# EAGLE design Y-babies ATtiny84 v07 (EAGLE 6.5.0)
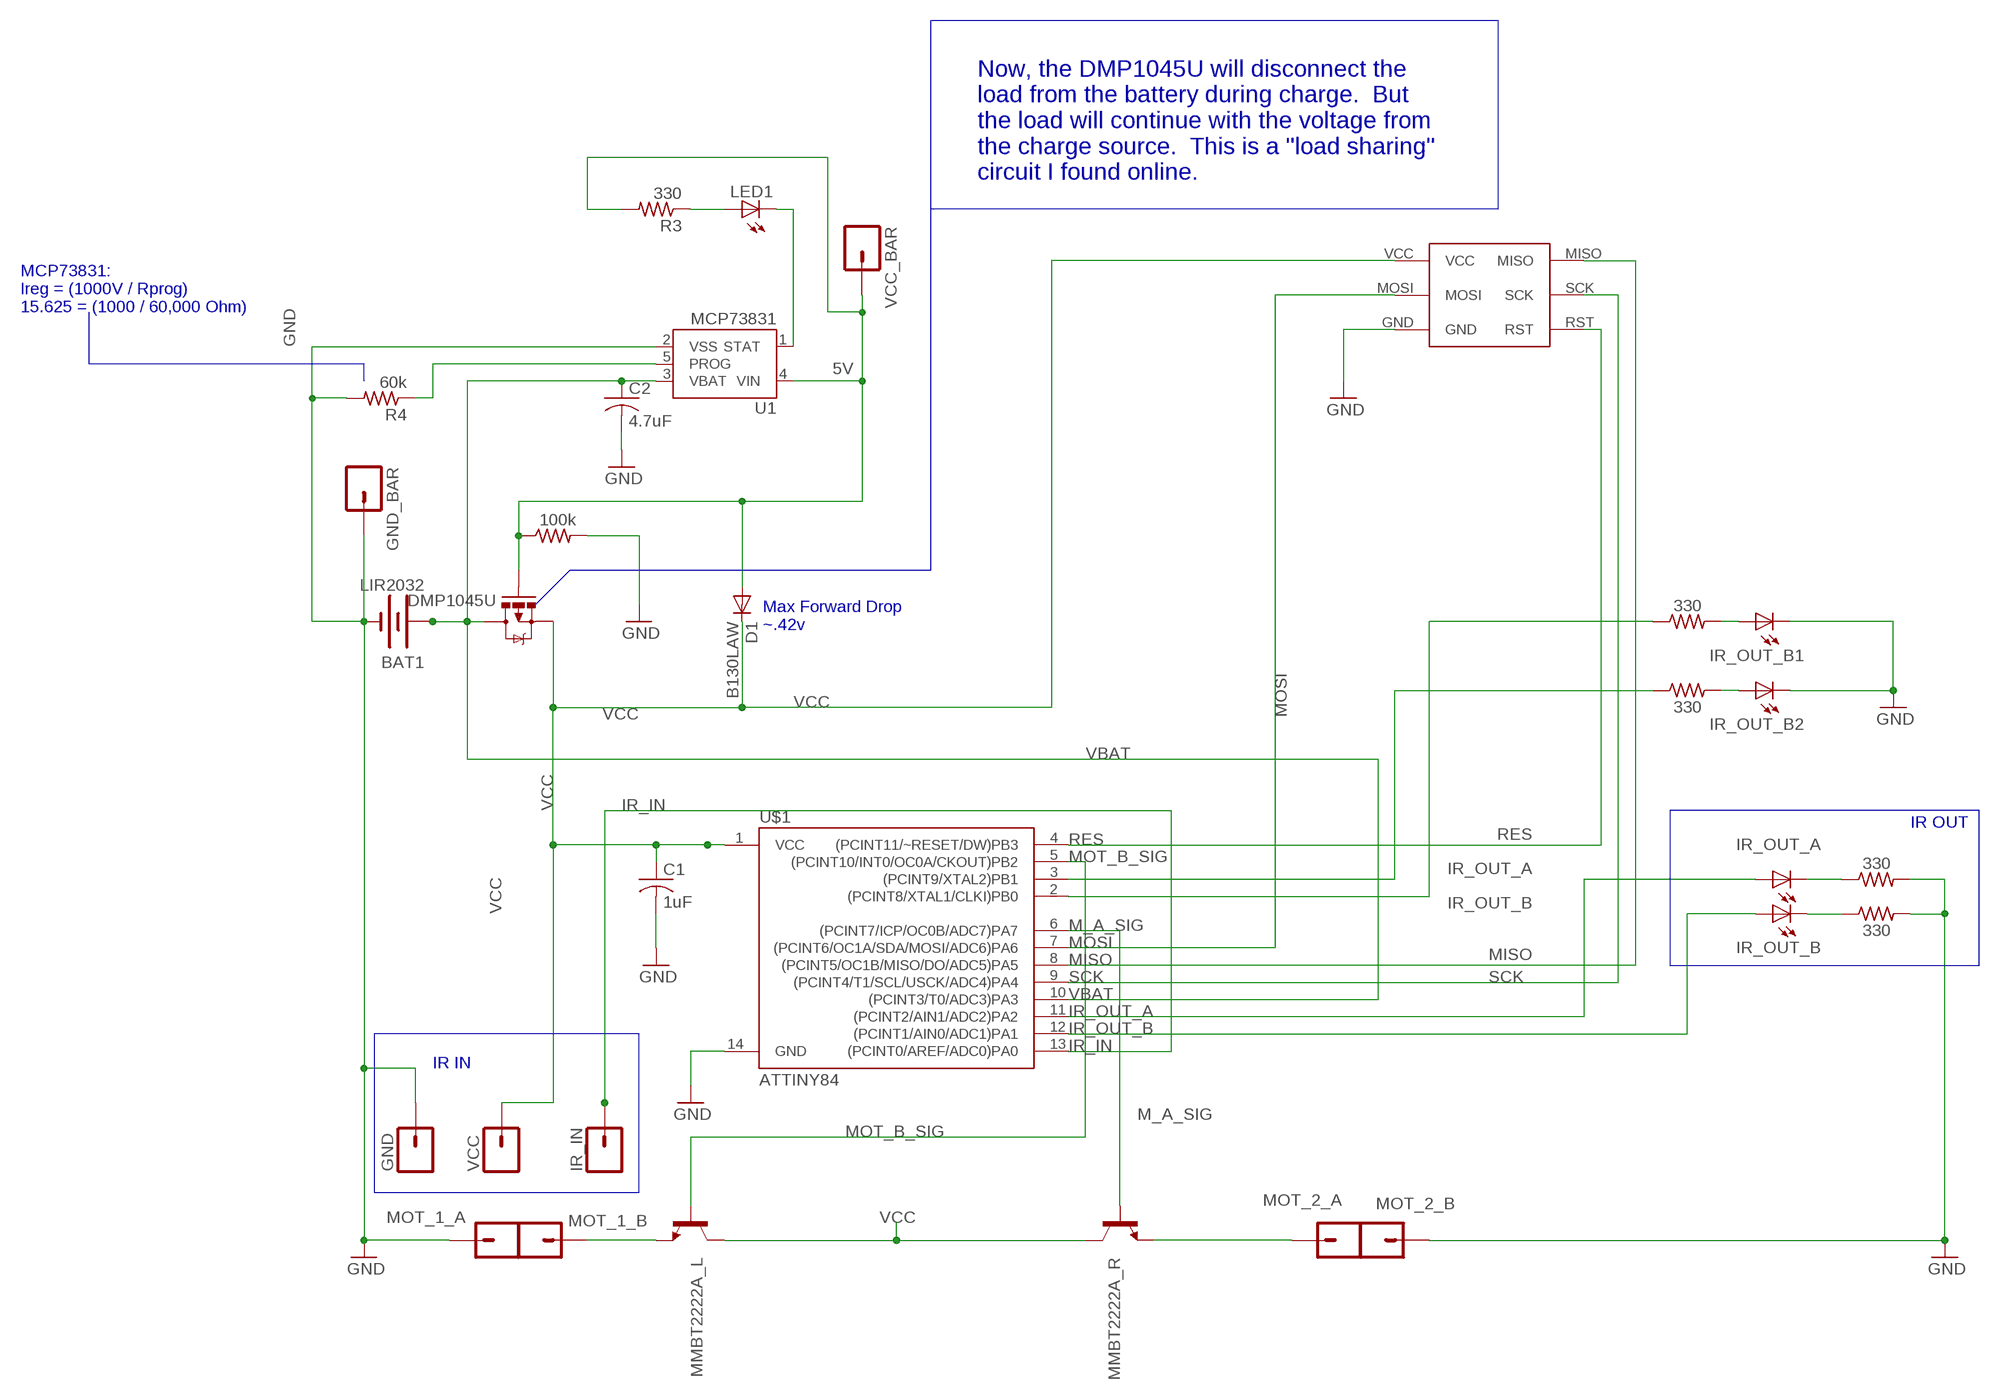
[diagram p0: schematic, sheet 1]

## Parts
BAT1  LIR2032  BATTERY20PTH  [BATTCOM_20MM_PTH]
C1  1uF  C-USC0402K  [C0402K]
C2  4.7uF  C-USC0805K  [C0805K]
D1  B130LAW  DIODE-SOD123  [SOD123]
DMP1045U  MOSFET-PCHANNELSMD  [SOT23-3]
GND  M01PTH  [1X01]
GND_BAR  M01PTH  [1X01]
IR_IN  M01PTH  [1X01]
IR_OUT_A  LED3MM  [LED3MM]
IR_OUT_B  LED3MM  [LED3MM]
IR_OUT_B1  LEDSML0603  [SML0603]
IR_OUT_B2  LEDSML0603  [SML0603]
LED1  LEDSML0603  [SML0603]
MMBT2222A_L  TRANSISTOR_NPNSOT23  [SOT23]
MMBT2222A_R  TRANSISTOR_NPNSOT23  [SOT23]
MOT_1_A  M01SMD-4.5X1.5  [PAD-1.5X4.5]
MOT_1_B  M01SMD-4.5X1.5  [PAD-1.5X4.5]
MOT_2_A  M01SMD-4.5X1.5  [PAD-1.5X4.5]
MOT_2_B  M01SMD-4.5X1.5  [PAD-1.5X4.5]
R1  330  R-US_R0402  [R0402]
R2  330  R-US_R0402  [R0402]
R3  330  R-US_R0402  [R0402]
R4  60k  R-US_R0402  [R0402]
R5  100k  R-US_R0402  [R0402]
R6  330  R-US_R0402  [R0402]
R7  330  R-US_R0402  [R0402]
U1  MCP73831  [SOT23-5]
U$1  ATTINY84  [SO14]
U$2  POGO_PIN_SPI_PAD  [POGO_PIN_SPI_PAD]
VCC  M01PTH  [1X01]
VCC_BAR  M01PTH  [1X01]

## Nets
5V: D1.A DMP1045U.1(G) R3.2 R5.1 U1.4(VIN) VCC_BAR.1
GND: BAT1.2(-) C1.2 C2.2 GND.1 GND_BAR.1 IR_OUT_B1.C IR_OUT_B2.C MOT_1_A.P$1 MOT_2_B.P$1 R1.2 R2.2 R4.2 R5.2 U1.2(VSS) U$1.14(GND) U$2.GND
IR_IN: IR_IN.1 U$1.13((PCINT0/AREF/ADC0)PA0)
IR_OUT_A: IR_OUT_A.A U$1.11((PCINT2/AIN1/ADC2)PA2)
IR_OUT_B: IR_OUT_B.A U$1.12((PCINT1/AIN0/ADC1)PA1)
M_A_IN: MMBT2222A_R.2(E) MOT_2_A.P$1
M_A_SIG: MMBT2222A_R.1(B) U$1.6((PCINT7/ICP/OC0B/ADC7)PA7)
MISO: U$1.8((PCINT5/OC1B/MISO/DO/ADC5)PA5) U$2.MISO
MOSI: U$1.7((PCINT6/OC1A/SDA/MOSI/ADC6)PA6) U$2.MOSI
MOT_B_IN: MMBT2222A_L.2(E) MOT_1_B.P$1
MOT_B_SIG: MMBT2222A_L.1(B) U$1.5((PCINT10/INT0/OC0A/CKOUT)PB2)
N$1: LED1.C U1.1(STAT)
N$2: LED1.A R3.1
N$3: R7.1 U$1.2((PCINT8/XTAL1/CLKI)PB0)
N$5: IR_OUT_B1.A R7.2
N$6: IR_OUT_B2.A R6.2
N$7: IR_OUT_A.K(C) R1.1
N$8: IR_OUT_B.K(C) R2.1
N$9: R6.1 U$1.3((PCINT9/XTAL2)PB1)
N$10: R4.1 U1.5(PROG)
RES: U$1.4((PCINT11/~RESET/DW)PB3) U$2.RST
SCK: U$1.9((PCINT4/T1/SCL/USCK/ADC4)PA4) U$2.SCK
VBAT: BAT1.1(+) C2.1 DMP1045U.3(D) U1.3(VBAT) U$1.10((PCINT3/T0/ADC3)PA3)
VCC: C1.1 D1.C DMP1045U.2(S) MMBT2222A_L.3(C) MMBT2222A_R.3(C) U$1.1(VCC) U$2.VCC VCC.1

## Buses
B$1
B$2
B$3
B$4

## Notes on the sheet
- Now, the DMP1045U will disconnect the
  load from the battery during charge.  But
  the load will continue with the voltage from
  the charge source.  This is a "load sharing" 
  circuit I found online.
- MCP73831:
  Ireg = (1000V / Rprog)
  15.625 = (1000 / 60,000 Ohm)
- Max Forward Drop
  ~.42v
- IR OUT
- IR IN

## Library data of the parts
BAT1 = SparkFun-Electromechanical:BATTERY: Battery Holders Various common sizes : AA, AAA, 20mm coin cell and 12mm coin cell. 20MM_4LEGS, BATT-10373
C1 C2 = resistor:C-US: CAPACITOR, American symbol
D1 = diode:DIODE-: DIODE
DMP1045U = SparkFun-DiscreteSemi:MOSFET-PCHANNEL: Generic PMOSFET
GND GND_BAR IR_IN MOT_1_A MOT_1_B MOT_2_A MOT_2_B VCC VCC_BAR = SparkFun:M01: Header 1 Standard 1-pin 0.1" header. Use with straight break away headers (SKU : PRT-00116), right angle break away headers (PRT-00553), swiss pins (PRT-00743), machine pins (PRT-00117), and female headers (PRT-00115).
IR_OUT_A IR_OUT_B IR_OUT_B1 IR_OUT_B2 LED1 = led:LED: LED OSRAM: - CHIPLED LG R971, LG N971, LY N971, LG Q971, LY Q971, LO R971, LY R971 LH N974, LH R974 LS Q976, LO Q976, LY Q976 LO Q996 - Hyper CHIPLED LW Q18S LB Q993, LB Q99A, LB R99A - SideLED LS A670, LO A670, LY A670, LG A670, LP A670 LB A673, LV A673, LT A673, LW A673 LH A674 LY A675 LS A676, LA A676, LO A676, LY A676, LW A676 LS A679, LY A679, LG A679 - Hyper Micro SIDELED® LS Y876, LA Y876, LO Y876, LY Y876 LT Y87S - SmartLED LW L88C, LW L88S LB L89C, LB L89S, LG L890 LS L89K, LO L89K, LY L89K LS L896, LA L896, LO L896, LY L896 - TOPLED LS T670, LO T670, LY T670, LG T670, LP T670 LSG T670, LSP T670, LSY T670, LOP T670, LYG T670 LG T671, LOG T671, LSG T671 LB T673, LV T673, LT T673, LW T673 LH T674 LS T676, LA T676, LO T676, LY T676, LB T676, LH T676, LSB T676, LW T676 LB T67C, LV T67C, LT T67C, LS T67K, LO T67K, LY T67K, LW E67C LS E67B, LA E67B, LO E67B, LY E67B, LB E67C, LV E67C, LT E67C LW T67C LS T679, LY T679, LG T679 LS T770, LO T770, LY T770, LG T770, LP T770 LB T773, LV T773, LT T773, LW T773 LH T774 LS E675, LA E675, LY E675, LS T675 LS T776, LA T776, LO T776, LY T776, LB T776 LHGB T686 LT T68C, LB T68C - Hyper Mini TOPLED® LB M676 - Mini TOPLED Santana® LG M470 LS M47K, LO M47K, LY M47K Source: http://www.osram.convergy.de LUXEON: - LUMILED® LXK2-PW12-R00, LXK2-PW12-S00, LXK2-PW14-U00, LXK2-PW14-V00 LXK2-PM12-R00, LXK2-PM12-S00, LXK2-PM14-U00 LXK2-PE12-Q00, LXK2-PE12-R00, LXK2-PE12-S00, LXK2-PE14-T00, LXK2-PE14-U00 LXK2-PB12-K00, LXK2-PB12-L00, LXK2-PB12-M00, LXK2-PB14-N00, LXK2-PB14-P00, LXK2-PB14-Q00 LXK2-PR12-L00, LXK2-PR12-M00, LXK2-PR14-Q00, LXK2-PR14-R00 LXK2-PD12-Q00, LXK2-PD12-R00, LXK2-PD12-S00 LXK2-PH12-R00, LXK2-PH12-S00 LXK2-PL12-P00, LXK2-PL12-Q00, LXK2-PL12-R00 Source: www.luxeon.com KINGBRIGHT: KA-3528ASYC Source: www.kingbright.com
MMBT2222A_L MMBT2222A_R = SparkFun:TRANSISTOR_NPN: Transistor NPN BJT configuration in SOT23 package. MMBT2222 is the common NPN we use. Double check BCE configuration again layout.
R1-R7 = resistor:R-US_: RESISTOR, American symbol
U1 = SparkFun-PowerIC:MCP73831: Miniature single cell, fully integrated Li-Ion, Li-polymer charge management controller http://ww1.microchip.com/downloads/en/DeviceDoc/21984a.pdf IC-09995; PROD_ID: IC-09995
U$1 = SparkFun-DigitalIC:ATTINY84: Atmel 14-pin 2/4/8kB flash uC
U$2 = Random parts:POGO_PIN_SPI_PAD

## Board
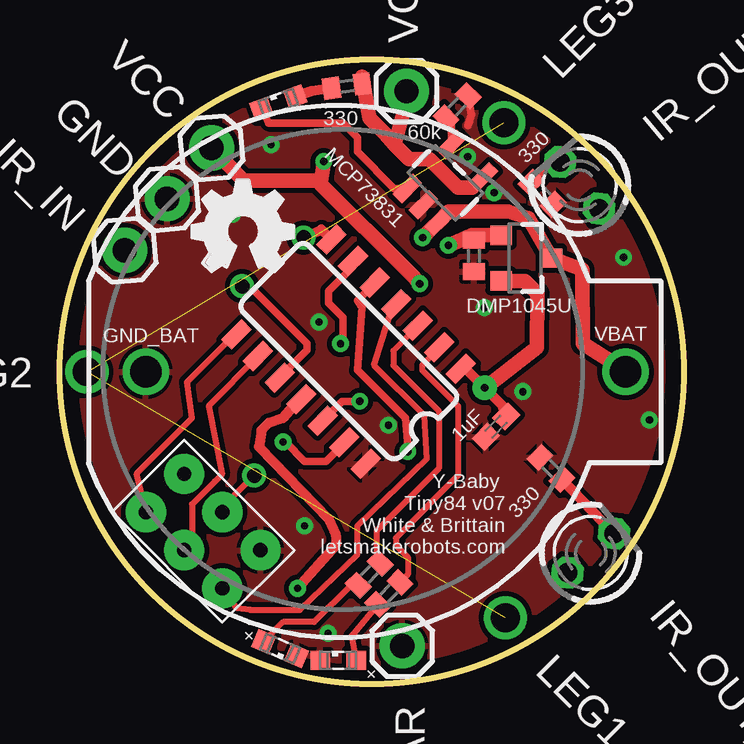
[diagram p1: board, top side]
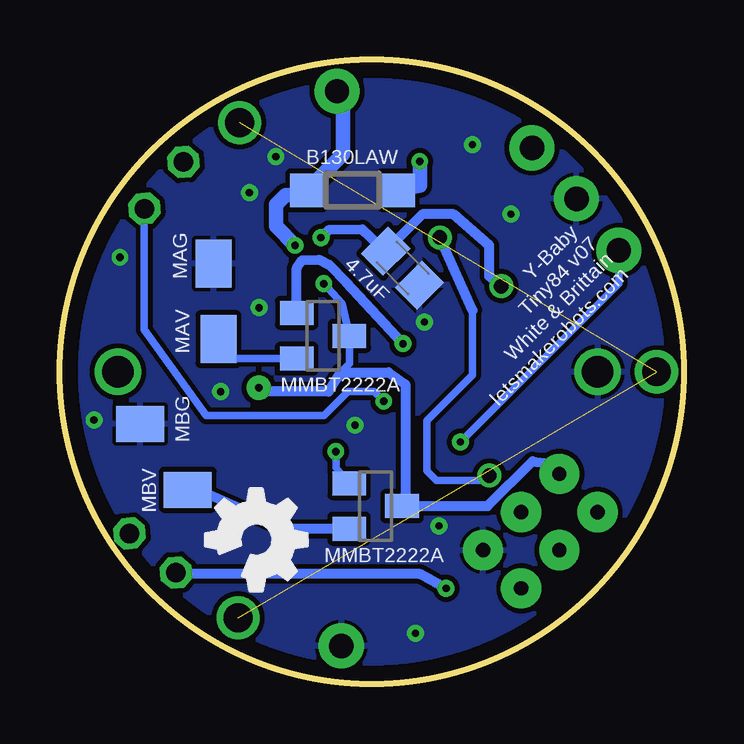
[diagram p2: board, bottom side, seen from below]

Size 26 x 26 mm. Coordinates in mm from the lower left corner, seen from the top.
Outline: circle at 13,13 radius 13
Copper layers (1*16): Top 0.035mm / dielectric 1.5mm / Bottom 0.035mm
Design rules "default *": minimum track width 10mil, minimum drill 24mil, track to track 8mil, track to pad 8mil, pad to pad 8mil, via to via 8mil, smd to smd 8mil, copper to edge 25mil, drill to drill 8mil, minimum pad ring 10mil, minimum via ring 8mil, stop-mask expansion 4mil, vias tented up to drill 0mil, thermal gap 6mil

### Footprints (pad centres in the part's own frame; a part is rotated, then mirrored left to right if it is on the bottom)
BATTCOM_20MM_PTH = drill 1.3: 1 11.85,0; 2 -8.15,0
C0402K = smd 0.925 x 0.74: 1 -0.6,0; 2 0.6,0
C0805K = smd 1.3 x 1.6: 1 -1,0; 2 1,0
SOD123 = smd 1.4 x 1.4: A 1.9,0; C -1.9,0
SOT23-3 = smd 0.8 x 0.9: 1 -0.95,-1; 2 0.95,-1; 3 0,1.1
1X01 = drill 1.016 pad 1.88: 1 0,0
LED3MM = drill 0.813 octagon: A -1.27,0; K 1.27,0
SML0603 = smd 0.8 x 0.8: A 0.75,0; C -0.75,0
SOT23 = smd 1 x 1.4: 1 -0.95,-1.1; 2 0.95,-1.1; 3 0,1.1
PAD-1.5X4.5 = smd 1.5 x 2: P$1 0,0
R0402 = smd 0.7 x 0.9: 1 -0.65,0; 2 0.65,0
SOT23-5 = smd 0.55 x 1.2: 1 -0.95,-1.3; 2 0,-1.3; 3 0.95,-1.3; 4 0.95,1.3; 5 -0.95,1.3
SO14 = smd 0.6 x 1.2: 1 -3.81,-2.8; 2 -2.54,-2.8; 3 -1.27,-2.8; 4 0,-2.8; 5 1.27,-2.8; 6 2.54,-2.8; 7 3.81,-2.8; 8 3.81,2.8; 9 2.54,2.8; 10 1.27,2.8; 11 0,2.8; 12 -1.27,2.8; 13 -2.54,2.8; 14 -3.81,2.8
POGO_PIN_SPI_PAD = drill 0.6 pad 1.676: GND 1,-1; MISO 3.25,-5.5; MOSI 1,-3.25; RST 3.25,-1; SCK 3.25,-3.25; VCC 1,-5.5

### Placement (x,y rotation side)
BAT1  11.73,13 0 top
C1  18.18,10.71 225 top
C2  11.71,17.32 315 bottom
D1  13.8,20.57 180 bottom
DMP1045U  19.39,17.74 270 top
GND  4.46,20.22 5 top
GND_BAR  14.27,1.57 0 top
IR_IN  2.7,18.06 5 top
IR_OUT_A  22.13,5.44 40 top
IR_OUT_B  21.67,20.77 130 top
IR_OUT_B1  11.6,0.97 0 top
IR_OUT_B2  9.18,1.45 157 top
LED1  9.11,24.22 20 top
MMBT2222A_L  12.84,7.4 270 bottom
MMBT2222A_R  15.03,14.5 270 bottom
MOT_1_A  22.65,10.82 270 bottom
MOT_1_B  20.67,8.08 270 bottom
MOT_2_A  19.39,14.36 0 bottom
MOT_2_B  19.6,17.51 0 bottom
R1  20.47,8.97 135 top
R2  20.11,20.44 315 top
R3  11.97,24.91 8 top
R4  16.56,24.05 45 top
R5  17.26,17.83 270 top
R6  12.89,4.56 225 top
R7  13.71,3.76 225 top
U1  16.07,20.88 315 top
U$1  12.04,13.84 135 top
U$2  9.77,5.56 225 top
U$3  [OSHW_FILLX150_NOTEXT]  5.5,17.17 0 top
U$4  [OSHW_FILLX150_NOTEXT]  20.51,6.32 315 bottom
VCC  6.32,22.33 5 top
VCC_BAR  14.45,24.7 0 top

### Tracks (layer width: path | path; a pad name or v marks a point on that pad's centre or on a via)
5V  (via drill 0.3)
  Top 0.406: 12.6,25.29 R3.2 | 17.5,18.69 R5.1 | 17.2,20.67 U1.4
  Top 0.61: 13.95,22.47 14.55,21.87 14.9,21.87 15.4,21.87 16.6,20.67 17.2,20.67 | 13.95,22.47 14.3,23.75 VCC_BAR.1 | 13.95,22.47 13.55,22.92 12.9,23.57 12.6,25.29 | DMP1045U.1 17.5,18.69 17.18,18.69 v16.2,18.27
  Bottom 0.61: VCC_BAR.1 14.2,24.45 14.2,22.07 D1.A 15.7,20.47 15.8,20.37 16.6,20.37 17,19.97 17,19.07 v16.2,18.27
GND  (via drill 0.3)
  Top 0.305: R4.2 17.15,23.72 17,23.27
  other vias: 24.58,10.99 10.2,6.57 18.1,20.47 8.8,22.47 10.8,15.07 13.7,10.77 23.5,17.77 17,21.97 19.3,12.17 7.2,19.57 17.7,15.67 11.18,2.09
  pour Top: -0.97,-0.97 26.97,-0.97 26.97,26.97 -0.97,26.97
  pour Bottom: -0.97,-0.97 26.97,-0.97 26.97,26.97 -0.97,26.97
IR_IN  (via drill 0.3)
  Top 0.305: U$1.13 11.85,10.02 11.1,9.27 10.2,9.27 9.4,10.07 v9.3,10.07
  Bottom 0.305: IR_IN.1 2.7,16.67 v9.3,10.07
IR_OUT_A  (via drill 0.3)
  Top 0.406: U$1.11 9.99,11.86 9.3,11.07 8.7,10.87 8.4,10.57 8.3,9.87 11.2,6.87 11.5,6.17 11.5,5.77 v9.9,3.97
  Bottom 0.406: v9.9,3.97 11,4.57 21.1,4.57 IR_OUT_A.A
IR_OUT_B  (via drill 0.3)
  Top 0.305: v12.5,11.77 11.76,11.77 U$1.12
  Bottom 0.305: IR_OUT_B.A 22.48,14.76 19.9,11.17 15,11.17 14,12.17 12.9,12.17 v12.5,11.77
LEG2  (via drill 1.2)  (2 unrouted)
  other vias: 1.13,13 18.52,23.38 18.57,2.74
M_A_IN
  Bottom 0.305: MMBT2222A_R.2 19.38,13.55 MOT_2_A.P$1
M_A_SIG  (via drill 0.3)
  Top 0.305: U$1.6 12.22,17.39 11.2,16.37 11.2,15.87 11.8,15.27 11.8,14.27 v11.7,14.17
  Bottom 0.406: MMBT2222A_R.1 16.13,17.32 15.9,17.65 15.2,17.67 14.77,17.45 14.08,16.75 v11.7,14.17
MISO
  Top 0.254: U$2.MISO 3.2,8.77 5.5,11.07 5.3,12.57 7.28,14.55 U$1.8
MOSI  (via drill 0.6)
  Top 0.254: U$2.MOSI 6.77,7.34 v8.1,8.67
  Top 0.406: v10.16,18.6 10.9,18.94 U$1.7
  Bottom 0.305: 8.8,15.57 8.8,12.87 10.7,10.97 10.7,8.87 10.3,8.47 8.3,8.47 v8.1,8.67
  Bottom 0.406: 8.8,15.57 v10.16,18.6
MOT_B_IN
  Bottom 0.305: 20.56,7.87 MOT_1_B.P$1
  Bottom 0.406: MMBT2222A_L.2 16.58,6.45 20.5,8.17 20.56,7.87
MOT_B_SIG  (via drill 0.3)
  Top 0.305: U$1.5 13.12,16.69 12.4,15.97 12.6,15.67 12.4,13.07 14.4,11.07 14.5,9.87 v14.5,9.67
  Bottom 0.305: 13.98,8.45 MMBT2222A_L.1 14.5,9.01 v14.5,9.67
N$1
  Top 0.305: 8.41,24.06 8.7,23.37 11.8,23.37 12.4,22.77 12.4,22.17 13.94,20.63 U1.1
  Top 0.406: LED1.C 8.41,24.06
N$2
  Top 0.406: R3.1 10.52,24.7 LED1.A
N$3
  Top 0.254: U$1.2 15.81,13.98 15.1,13.27 15.1,13.07 16.6,11.57 16.6,8.67 14,6.07 14,5.77 14.5,5.27 14.5,4.55 R7.1
N$5
  Top 0.254: R7.2 12.15,1.97 IR_OUT_B1.A
N$6
  Top 0.254: R6.2 12.13,4.1 10.6,2.57 9.31,2.57 IR_OUT_B2.A
N$7
  Top 0.406: IR_OUT_A.K 23.08,6.26 R1.1
N$8
  Top 0.305: IR_OUT_B.K 20.49,21.75 R2.1
N$9
  Top 0.254: U$1.3 14.91,14.88 13.9,13.87 13.9,13.27 15.8,11.37 15.8,8.97 13.2,6.37 13.2,5.17 R6.1
N$10
  Top 0.305: U1.5 16.32,23.37 R4.1
RES
  Top 0.254: U$2.RST 7.37,3.14 7.94,3.07 10,3.07 12.4,5.37 12.4,6.57 15.3,9.37 15.2,11.17 13.1,13.27 13.8,15.51 U$1.4
SCK
  Top 0.254: U$1.9 6.2,11.57 6.76,8.71 6.46,8.43 5.5,7.47 5.5,5.88 U$2.SCK
VBAT  (via drill 0.3, 0.6)
  Top 0.305: U$1.10 10.3,13.9 10.3,14.17 7.9,16.57 v7.6,16.57 | 23.58,13.06 BAT1.1
  Top 0.61: BAT1.1 23.54,13 | 23.58,13.06 21.8,14.17 21.79,17.25 DMP1045U.3 19.53,19.4 18.69,19.67 16.2,19.67 U1.3 15.52,18.99 v15.12,18.59
  Bottom 0.305: v15.12,18.59 14.82,18.89 14.81,18.9
  Bottom 0.406: v7.6,16.57 8.1,16.97 8.1,18.27 9.6,19.57 10.88,19.57 C2.1 13.39,18.93 14.81,18.9 v15.12,18.59
VCC  (via drill 0.3, 0.3 pad 0.3, 0.3 pad 1.02)
  Top 0.305: U$1.1 16.74,13.13
  Top 0.406: 10.67,20.97 10.97,21.24 v11,21.77 | C1.1 18.44,11.6 v17.71,12.33 16.91,13.13 U$1.1
  Top 0.61: 10.67,20.97 7.66,20.97 VCC.1 | v15,16.67 14.57,17.13 10.87,20.83 v11,21.77 | DMP1045U.2 19.38,16.79 19.9,16.27 19.89,14.01 v17.71,12.33
  Bottom 0.305: v15,16.67 14.23,15.84 MMBT2222A_R.3 13.93,13.34 14.3,12.97
  Bottom 0.406: U$2.VCC 5.61,9.17 6.3,9.27 8.17,7.4 MMBT2222A_L.3 11.6,7.74 11.6,12.47 12.3,12.97 14.3,12.97 14.8,12.17 17.55,12.17 v17.71,12.33 17.64,12.33
  Bottom 0.61: v11,21.77 11,20.77 D1.C

### Text on the board
_tsilk: LEG3 | 330 | 60k | 330 | MCP73831 | DMP1045U | GND_BAT | VBAT | LEG2 | 1uF | Y-Baby / Tiny84 v07 / White & Brittain / letsmakerobots.com | 330 | + | + | LEG1
_bsilk: B130LAW | Y-Baby / Tiny84 v07 / White & Brittain / letsmakerobots.com | 4.7uF | MAG | MAV | MMBT2222A | MBG | MBV | MMBT2222A